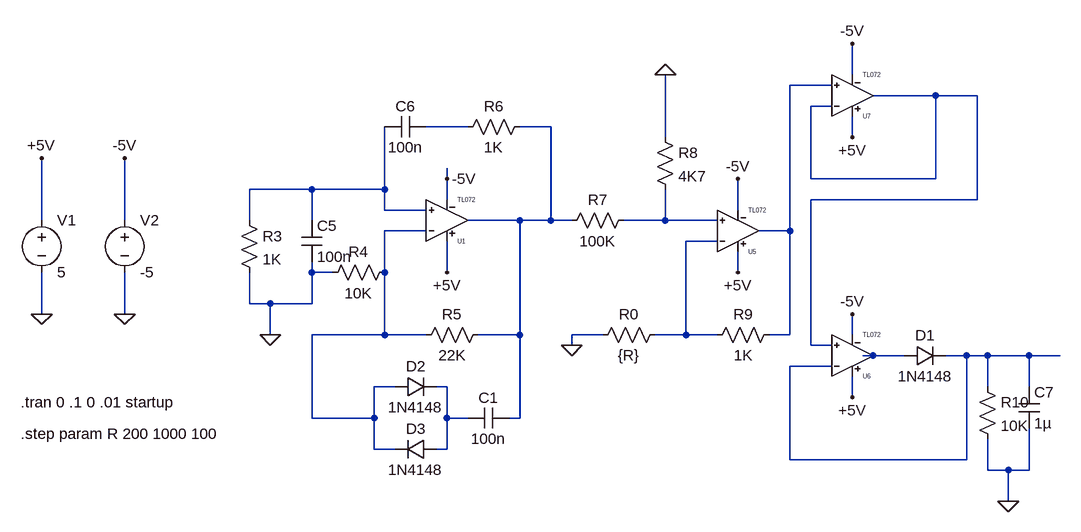
[diagram p0: schematic ECCircuit.asc]
ECCircuit.asc, the LTspice schematic file:
Version 4
SHEET 1 1632 680
WIRE 768 -96 768 -144
WIRE 736 -80 672 -80
WIRE 896 -64 800 -64
WIRE 960 -64 896 -64
WIRE 736 -48 704 -48
WIRE 176 -16 112 -16
WIRE 304 -16 256 -16
WIRE 480 0 480 -96
WIRE 768 0 768 -32
WIRE 144 64 144 48
WIRE 704 64 704 -48
WIRE 896 64 896 -64
WIRE 896 64 704 64
WIRE -64 80 -160 80
WIRE 48 80 48 -16
WIRE 48 80 -64 80
WIRE 144 96 144 64
WIRE 960 96 960 -64
WIRE 960 96 704 96
WIRE 48 112 48 80
WIRE 112 112 48 112
WIRE 592 112 592 64
WIRE -480 128 -480 32
WIRE -352 128 -352 32
WIRE -160 128 -160 80
WIRE -64 128 -64 80
WIRE 256 128 176 128
WIRE 304 128 304 -16
WIRE 304 128 256 128
WIRE 336 128 304 128
WIRE 480 128 480 80
WIRE 480 128 416 128
WIRE 560 128 480 128
WIRE 112 144 48 144
WIRE 672 144 672 -80
WIRE 672 144 624 144
WIRE 560 160 512 160
WIRE -64 208 -64 192
WIRE -32 208 -64 208
WIRE 48 208 48 144
WIRE 144 208 144 160
WIRE 592 208 592 176
WIRE -160 256 -160 208
WIRE -128 256 -160 256
WIRE -64 256 -64 208
WIRE -64 256 -128 256
WIRE -480 272 -480 208
WIRE -352 272 -352 208
WIRE -128 304 -128 256
WIRE 48 304 48 208
WIRE 48 304 -64 304
WIRE 112 304 48 304
WIRE 256 304 256 128
WIRE 256 304 192 304
WIRE 384 304 336 304
WIRE 512 304 512 160
WIRE 512 304 464 304
WIRE 560 304 512 304
WIRE 672 304 672 144
WIRE 672 304 640 304
WIRE 768 304 768 272
WIRE 336 320 336 304
WIRE 704 320 704 96
WIRE 736 320 704 320
WIRE 800 336 784 336
WIRE 848 336 800 336
WIRE 944 336 912 336
WIRE 976 336 944 336
WIRE 1040 336 976 336
WIRE 1088 336 1040 336
WIRE 736 352 672 352
WIRE 64 384 32 384
WIRE 144 384 128 384
WIRE 976 384 976 336
WIRE 1040 384 1040 336
WIRE 768 400 768 368
WIRE -64 432 -64 304
WIRE 32 432 32 384
WIRE 32 432 -64 432
WIRE 144 432 144 384
WIRE 176 432 144 432
WIRE 256 432 256 304
WIRE 256 432 240 432
WIRE 32 480 32 432
WIRE 64 480 32 480
WIRE 144 480 144 432
WIRE 144 480 128 480
WIRE 672 496 672 352
WIRE 944 496 944 336
WIRE 944 496 672 496
WIRE 976 512 976 464
WIRE 1008 512 976 512
WIRE 1040 512 1040 448
WIRE 1040 512 1008 512
WIRE 1008 560 1008 512
FLAG -128 304 0
FLAG 144 64 -5V
FLAG 144 208 +5V
FLAG -480 272 0
FLAG -352 272 0
FLAG -480 32 +5V
FLAG -352 32 -5V
FLAG 480 -96 0
FLAG 592 64 -5V
FLAG 592 208 +5V
FLAG 336 320 0
FLAG 768 0 +5V
FLAG 768 -144 -5V
FLAG 768 400 +5V
FLAG 768 272 -5V
FLAG 1008 560 0
SYMBOL res -176 112 R0
SYMATTR InstName R3
SYMATTR Value 1K
SYMBOL res 272 -32 R90
WINDOW 0 0 56 VBottom 2
WINDOW 3 32 56 VTop 2
SYMATTR InstName R6
SYMATTR Value 1K
SYMBOL res 64 192 R90
WINDOW 0 0 56 VBottom 2
WINDOW 3 32 56 VTop 2
SYMATTR InstName R4
SYMATTR Value 10K
SYMBOL res 208 288 R90
WINDOW 0 0 56 VBottom 2
WINDOW 3 32 56 VTop 2
SYMATTR InstName R5
SYMATTR Value 22K
SYMBOL res 432 112 R90
WINDOW 0 0 56 VBottom 2
WINDOW 3 32 56 VTop 2
SYMATTR InstName R7
SYMATTR Value 100K
SYMBOL res 464 -16 R0
SYMATTR InstName R8
SYMATTR Value 4K7
SYMBOL cap -80 128 R0
SYMATTR InstName C5
SYMATTR Value 100n
SYMBOL cap 112 -32 R90
WINDOW 0 0 32 VBottom 2
WINDOW 3 32 32 VTop 2
SYMATTR InstName C6
SYMATTR Value 100n
SYMBOL voltage -480 112 R0
WINDOW 123 0 0 Left 2
WINDOW 39 0 0 Left 2
SYMATTR InstName V1
SYMATTR Value 5
SYMBOL voltage -352 112 R0
WINDOW 123 0 0 Left 2
WINDOW 39 0 0 Left 2
SYMATTR InstName V2
SYMATTR Value -5
SYMBOL diode 848 352 R270
WINDOW 0 32 32 VTop 2
WINDOW 3 0 32 VBottom 2
SYMATTR InstName D1
SYMATTR Value 1N4148
SYMBOL res 656 288 R90
WINDOW 0 0 56 VBottom 2
WINDOW 3 32 56 VTop 2
SYMATTR InstName R9
SYMATTR Value 1K
SYMBOL res 480 288 R90
WINDOW 0 0 56 VBottom 2
WINDOW 3 32 56 VTop 2
SYMATTR InstName R0
SYMATTR Value {R}
SYMBOL cap 240 416 R90
WINDOW 0 0 32 VBottom 2
WINDOW 3 32 32 VTop 2
SYMATTR InstName C1
SYMATTR Value 100n
SYMBOL diode 64 400 R270
WINDOW 0 32 32 VTop 2
WINDOW 3 0 32 VBottom 2
SYMATTR InstName D2
SYMATTR Value 1N4148
SYMBOL diode 128 496 M270
WINDOW 0 32 32 VTop 2
WINDOW 3 0 32 VBottom 2
SYMATTR InstName D3
SYMATTR Value 1N4148
SYMBOL res 960 368 R0
SYMATTR InstName R10
SYMATTR Value 10K
SYMBOL cap 1024 384 R0
SYMATTR InstName C7
SYMATTR Value 1µ
SYMBOL TL072 144 192 M180
SYMATTR InstName U1
SYMBOL TL072 592 208 M180
SYMATTR InstName U5
SYMBOL TL072 768 400 M180
SYMATTR InstName U6
SYMBOL TL072 768 0 M180
SYMATTR InstName U7
TEXT -512 408 Left 2 !.tran 0 .1 0 .01 startup
TEXT -512 456 Left 2 !.step param R 200 1000 100

The netlist it stands for:
* ECCircuit.asc
R3 N005 0 1K
R6 N004 N003 1K
R4 N007 0 10K
R5 N004 N007 22K
R7 N006 N004 100K
R8 0 N006 4K7
C5 N005 0 100n
C6 N003 N005 100n
V1 +5V 0 5
V2 -5V 0 -5
D1 N009 N010 1N4148
R9 N001 N008 1K
R0 N008 0 {R}
C1 N004 N011 100n
D2 N007 N011 1N4148
D3 N011 N007 1N4148
R10 N010 0 10K
C7 N010 0 1µ
XU1 N005 N007 +5V -5V N004 TL072  ; pins In+ In- V+ V- OUT
XU5 N006 N008 +5V -5V N001 TL072  ; pins In+ In- V+ V- OUT
XU6 N002 N010 +5V -5V N009 TL072  ; pins In+ In- V+ V- OUT
XU7 N001 N002 +5V -5V N002 TL072  ; pins In+ In- V+ V- OUT
.model D D
.lib standard.dio
.tran 0 .1 0 .01 startup
.step param R 200 1000 100
.lib TL072.sub
.backanno
.end